# Altium schematic sheet QCopterFC_USB_Sch.SchDoc
size A4
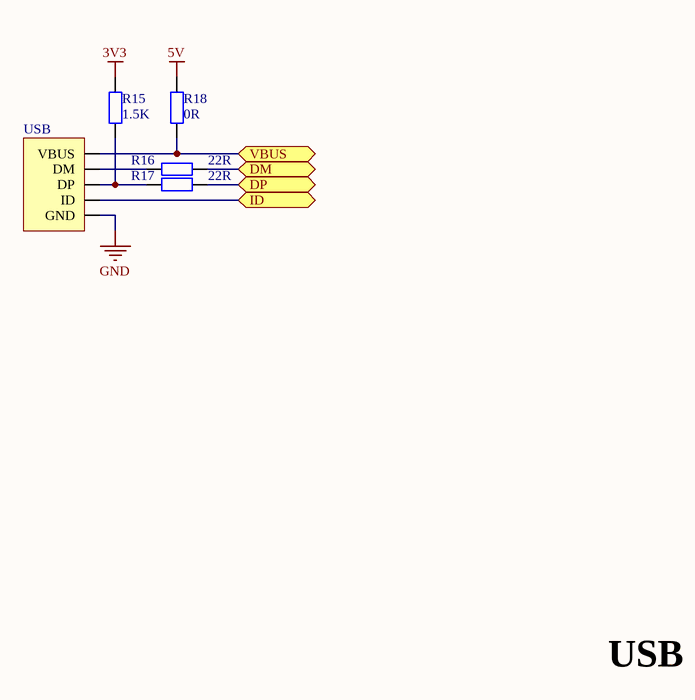
[diagram p0: QCopterFC_USB_Sch.SchDoc]

## Parts
R15  value 1.5K  [RES_0603]  (hidden comment: Res_0603)
R16  value 22R  [RES_0603]  (hidden comment: Res_0603)
R17  value 22R  [RES_0603]  (hidden comment: Res_0603)
R18  value 0R  [RES_0603]  (hidden comment: Res_0603)
USB  USB_Micro  [USB_MICRO_B]  (value not drawn)

## Ports
DM, DP, ID, VBUS

## Nets
3V3: R15.2
5V: R18.1
GND: USB.5(GND)
DM: R16.2 ; port DM
DP: R17.2 ; port DP
ID: USB.4(ID) ; port ID
VBUS: R18.2 USB.1(VBUS) ; port VBUS
NetR15_1: R15.1 R17.1 USB.3(DP)
NetR16_1: R16.1 USB.2(DM)

## Notes on the sheet
- USB

## Library data of the parts
R15-R18 = Res_0603: Resistor
USB = USB_Micro: USB